# Altium schematic sheet Power.SchDoc: Megabit Final Power
size A4; DocumentNumber: 4; Revision: 1; SheetNumber: 4; SheetTotal: 5
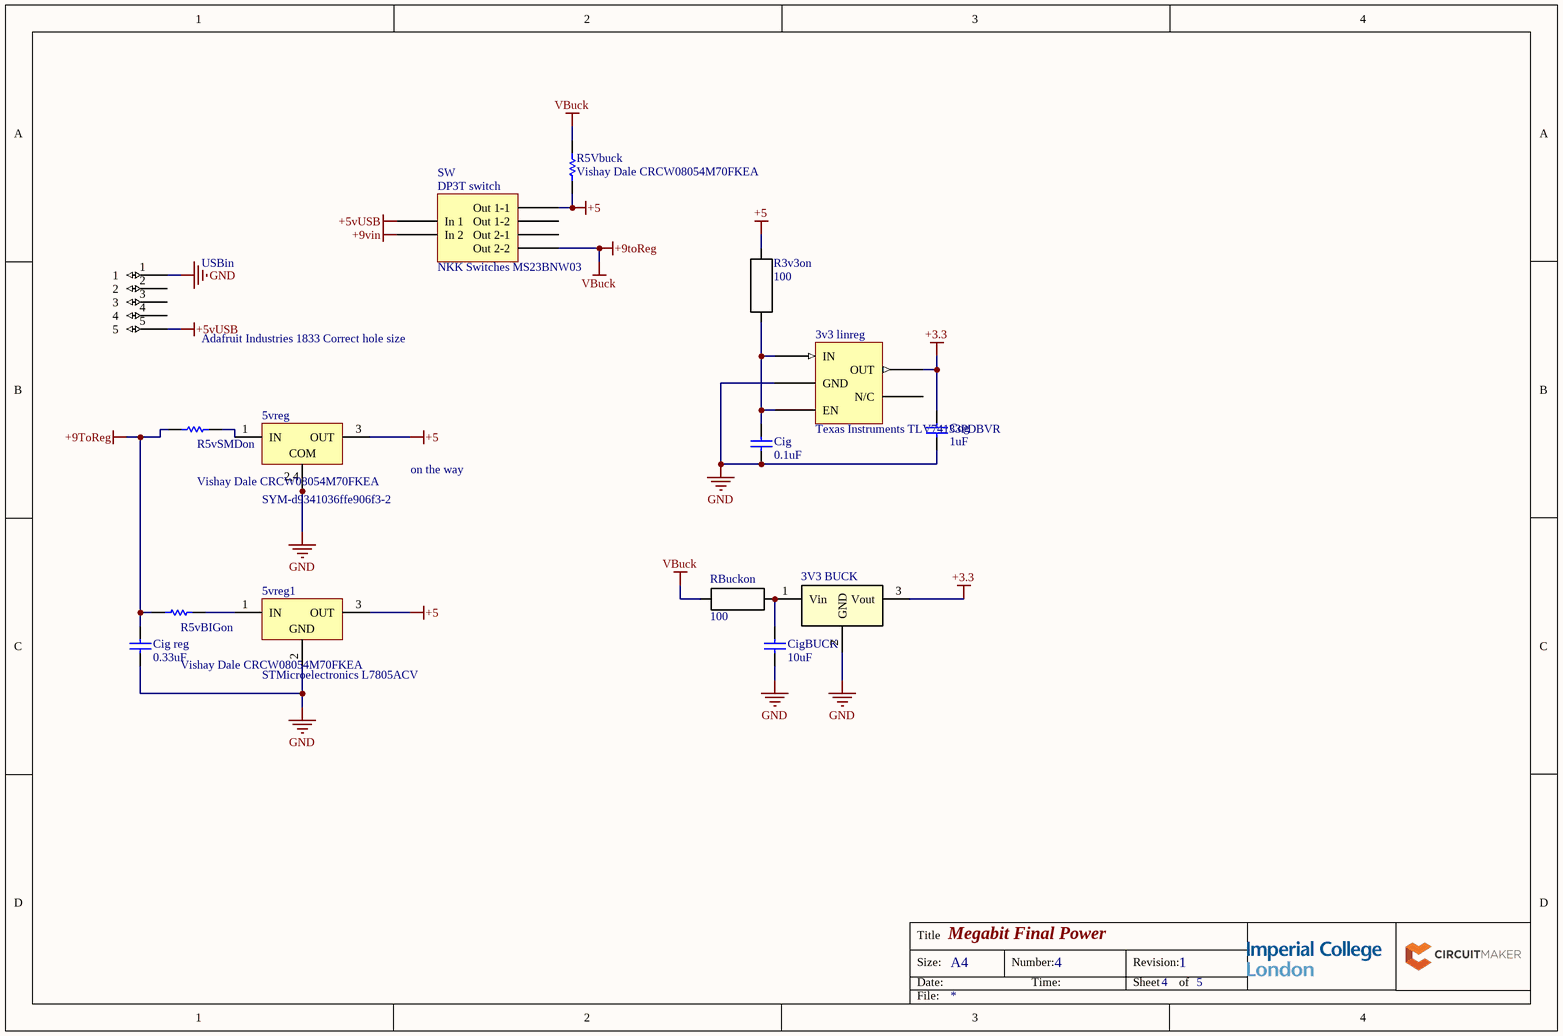
[diagram p0: Power.SchDoc]

## Parts
3V3_BUCK  Tracopower TSR 1-2433  [PCB-vczw4772xz5kvcrv4x78-1]  (value not drawn)
3v3_linreg  Texas Instruments TLV74133PDBVR  [PCB-e30blpvsozc7nnftiis2-1]
5vreg  SYM-d9341036ffe906f3-2  [SOT230P700X180-4L]
5vreg1  STMicroelectronics L7805ACV  [PCB-rumztmkd2xxusznmwboq-1]
Cig  0.1uF  [Vishay K104K15X7RF5TL2]
Cig_reg  0.33uF  [Vishay K104K15X7RF5TL2]
CigBUCK  10uF  [Vishay K104K15X7RF5TL2]
Cog  1uF  [Vishay K104K15X7RF5TL2]
R3v3on  100  [PCB-82a1bnj7v2r60fjh59dm-1]
R5vBIGon  Vishay Dale CRCW08054M70FKEA  [RESC2013X50X30LL20T20]
R5Vbuck  Vishay Dale CRCW08054M70FKEA  [RESC2013X50X30LL20T20]
R5vSMDon  Vishay Dale CRCW08054M70FKEA  [RESC2013X50X30LL20T20]
RBuckon  100  [PCB-82a1bnj7v2r60fjh59dm-1]
SW  NKK Switches MS23BNW03  [PCB-eozfiwzr1uk89188ni00-1]
USBin  Adafruit Industries 1833 Correct hole size  [PCB-lrx1ysvqy1j2hi3n37c6-1]

## Nets
+3.3: 3V3_BUCK.3(Vout) 3v3_linreg.4(OUT) Cog.2
+5: 5vreg.3(OUT) 5vreg1.3(OUT) R3v3on.1 R5Vbuck.2 SW.1(Out_1-1)
+5vUSB: SW.2(In_1) USBin.5
+9ToReg: Cig_reg.2 R5vBIGon.2 R5Vbuck.1 R5vSMDon.2 RBuckon.1 SW.6(Out_2-2)  [also labelled VBuck]
+9vin: SW.5(In_2)
GND: 3V3_BUCK.2(GND) 3v3_linreg.2(GND) 5vreg.2(COM) 5vreg.4 5vreg1.2(GND) Cig.1 Cig_reg.1 CigBUCK.1 Cog.1 USBin.1
Net3V3_BUCK_1: 3V3_BUCK.1(Vin) CigBUCK.2 RBuckon.2
Net3v3_linreg_1: 3v3_linreg.1(IN) 3v3_linreg.3(EN) Cig.2 R3v3on.2
Net5vreg1_1: 5vreg1.1(IN) R5vBIGon.1
Net5vreg_1: 5vreg.1(IN) R5vSMDon.1

Not connected (* = marked no-connect by the designer): 3v3_linreg 5(N/C); SW 3(Out_1-2) 4(Out_2-1); USBin 2 3 4

## Notes on the sheet
- on the way
- Title
- Size:
- Date:
- A4
- Number:
- Time:
- Revision:
- Sheet
- of
- File:
- (in symbol CMP-d9341036ffe906f3-4) 2,4
- (in symbol CMP-e82c21266ecb37eb-4) DP3T switch

## Library data of the parts
3V3_BUCK = CMP-395cf0c79334e69b-1: 1 A Watt, 4.75-36VDCVin, Quad Output, 3.3 V@1 A Switching Regulators DC-DC Converter; Number of Outputs: 1; Output Voltage: 3.30 V; Input Voltage (DC): 4.75 V to 36.0 V; Output Current: 1.00 A; RoHS: Compliant; REACH SVHC Compliance: No SVHC; Size-Width: 7.60 mm; Mounting Style: PCB; Octopart URL: http://octopart.com/tsr+1-2433-tracopower-9539342; Size-Height: 10.2 mm; Manufacturer Part Number: TSR 1-2433; OctopartID: 395cf0c79334e69b
3v3_linreg = CMP-ad66616159c672a1-6: 150mA Low-Dropout (LDO) Regulator With Foldback Current Limit for Portable Devices 5-SOT-23 -40 to 125
5vreg = CMP-d9341036ffe906f3-4: 3/4 Pin 500mA Fixed 5V Positive Voltage Regulator 4-SOT-223 0 to 125; Input Voltage (DC): 25.0 V (max); Lead-Free Status: Lead Free; Supply Voltage (DC): 25.0 V; Output Capacitor Type: Capacitor Free; Case/Package: SOT-223
5vreg1 = CMP-1170713-16: L7805 Series 1.5 A 5 V Three Terminal Voltage Regulator - TO-220; Dropout Voltage: 2.00 V; Output Voltage: 5.00 V (max); Number of Outputs: 1; Input Voltage (DC): 20.0 V (max); Lead-Free Status: Lead Free; Output Current: 1.00 A, 1.50 A; OctopartID: b0837beb020f6f44; Operating Temperature: 0.00 °C to 150 °C; Mounting Style: Through Hole; Manufacturer Part Number: L7805ACV; Lifecycle Status: Active; REACH SVHC Compliance: No SVHC; Case/Package: TO-220; RoHS: Compliant; Number of Pins: 3; Packaging: Tube; Octopart URL: https://octopart.com/l7805acv-stmicroelectronics-40015850
Cig Cig_reg CigBUCK Cog = CMP-124240-16: K Series 100nF 50 V ±10 % Tolerance X7R Radial Multilayer Ceramic Capacitor; Manufacturer Part Number: K104K15X7RF5TL2; Lead Length: 30mm; Lead-Free Status: Lead Free; Voltage Rating (DC): 50 V; Capacitance Tolerance: ±10%; Size-Height: 5.6mm; Size-Width: 4.0mm; Mounting Style: Through Hole; OctopartID: e7292e20c87538ee; Number of Pins: 2; Packaging: Cut Tape (CT), Tape & Reel (TR); Capacitance: 100 nF; Octopart URL: http://octopart.com/k104k15x7rf5tl2-vishay+bccomponents-199226; Dielectric Material: Ceramic; Dielectric Characteristic: X7R; Size-Lead Diameter: 0.5mm; RoHS: Compliant; Size-Thickness: 2.6mm
R3v3on RBuckon = CMP-1867413-5: Resistor 0805 125mW; Resistance: Any resistance; Voltage Rating (DC): 150 V; Temperature Coefficient: -100 ppm/°C to 100 ppm/°C; Mounting Style: Surface Mount; Size-Width: 1.25 mm; Size-Height: 450 µm; Size-Length: 2.00 mm; Case/Package: 0805; OctopartID: dd051650670a02c2; Power Rating: 125 mW; Operating Temperature: 155 °C (max)
R5vBIGon R5Vbuck R5vSMDon = CMP-1857827-1: Thick Film Resistors - SMD 1/8watt 4.7Mohms 1%; Case Width: 1.25 mm; Case Height: 0.45 mm; Unit Weight: 0.000194 oz; Voltage Rating: 150 V; Brand: Vishay / Dale; Power Rating: 125 mW (1/8 W); Case Length: 2 mm; Temperature Coefficient: 100 PPM / K; Ciiva URL: https://ciiva.com/part/crcw08054m70fkea-1857827; Case Code - in: 0805; Manufacturer: Vishay; Operating Temperature Range: - 55 C to + 155 C; Packaging: Reel; Manufacturer Part Number: CRCW08054M70FKEA; Series: CRCW; Resistance: 4.7 MOhms; Termination Style: SMD/SMT; Factory Pack Quantity: 5000; Package / Case: 0805 (2012 metric); CiivaID: 1857827; Product: Thick Film Resistors SMD; RoHS: Details; Product Category: Thick Film Resistors - SMD; Case Code - mm: 2012; Tolerance: 1 %; Dimensions: 1.25 mm W x 2 mm L x 0.45 mm H
SW = CMP-e82c21266ecb37eb-4: dp3t on off on switch
USBin = CMP-bfb17591a6f36076-2: Standoff; Threaded Female 1/4 Hex; 6-32 Thread; Length .875; Brass/Zinc; Manufacturer Part Number: 1833; Lead-Free Status: Lead Free; OctopartID: bfb17591a6f36076; Size-Width: 6.35 mm; Size-Diameter: 6.35 mm; Octopart URL: http://octopart.com/1833-adafruit+industries-53099556; Material: Brass; Size-Length: 22.2 mm; Gender: Female; RoHS: Compliant